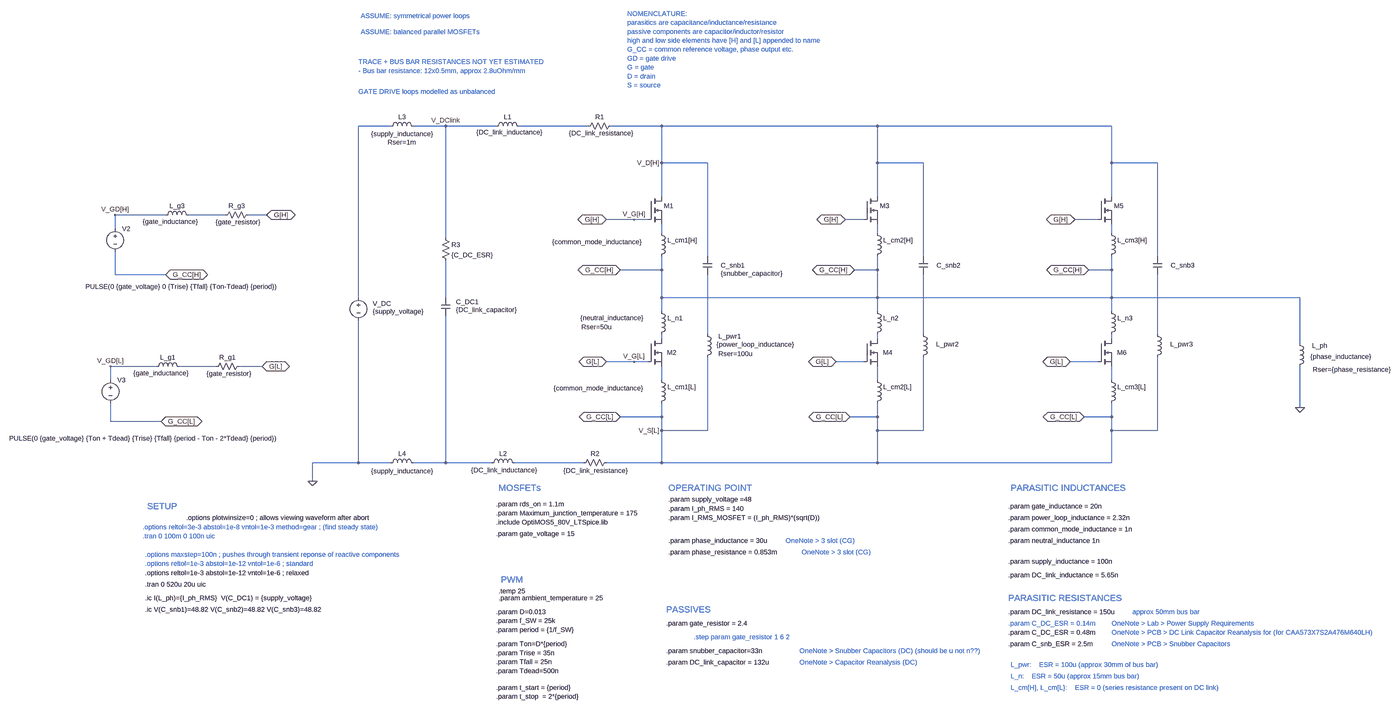
[diagram p0: schematic InverterBalanced.asc, whole sheet]
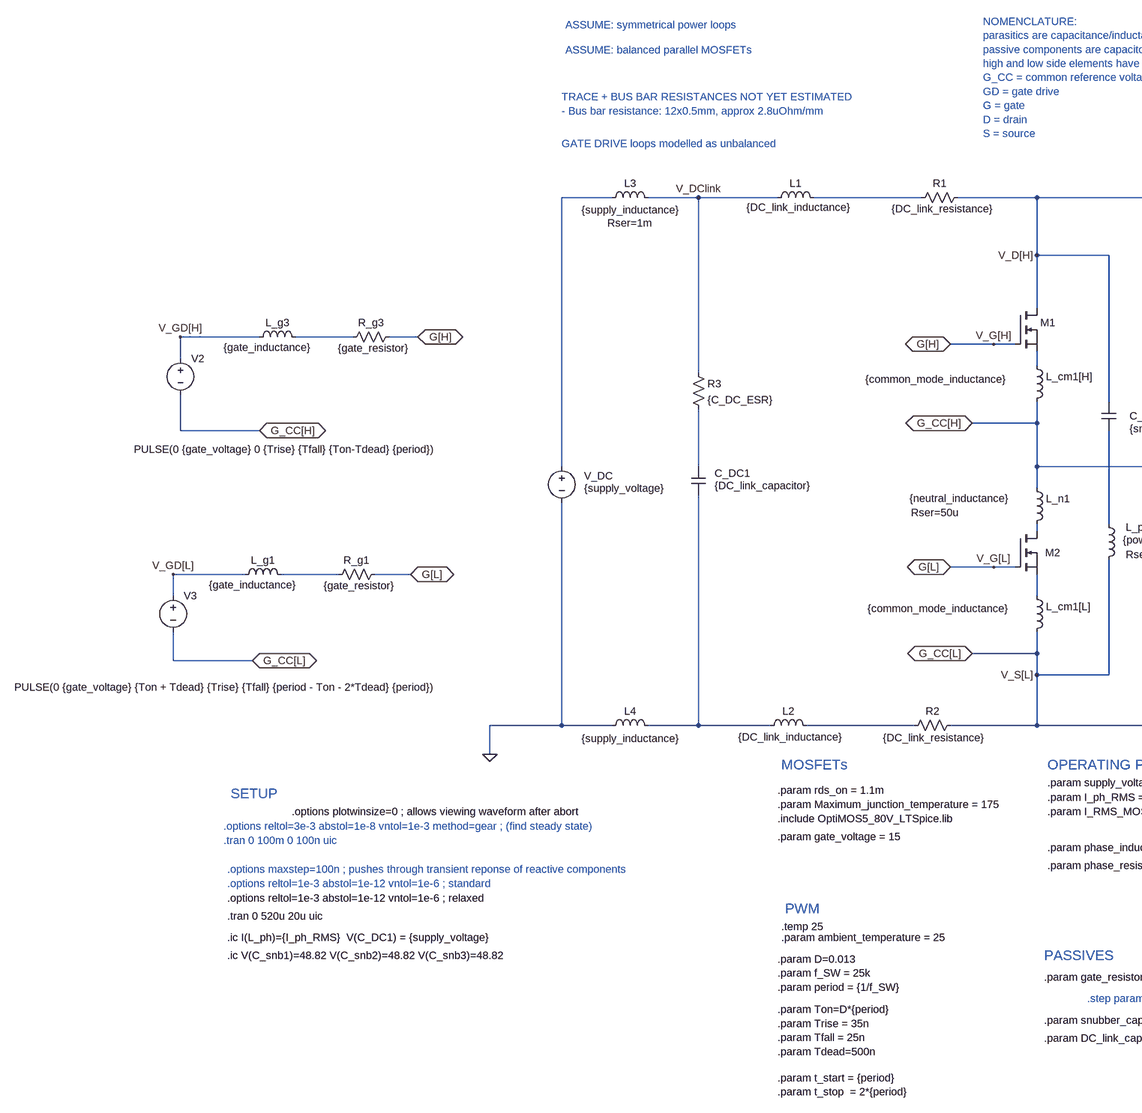
[diagram p1: schematic InverterBalanced.asc, part, row 1 of 1, column 1 of 2]
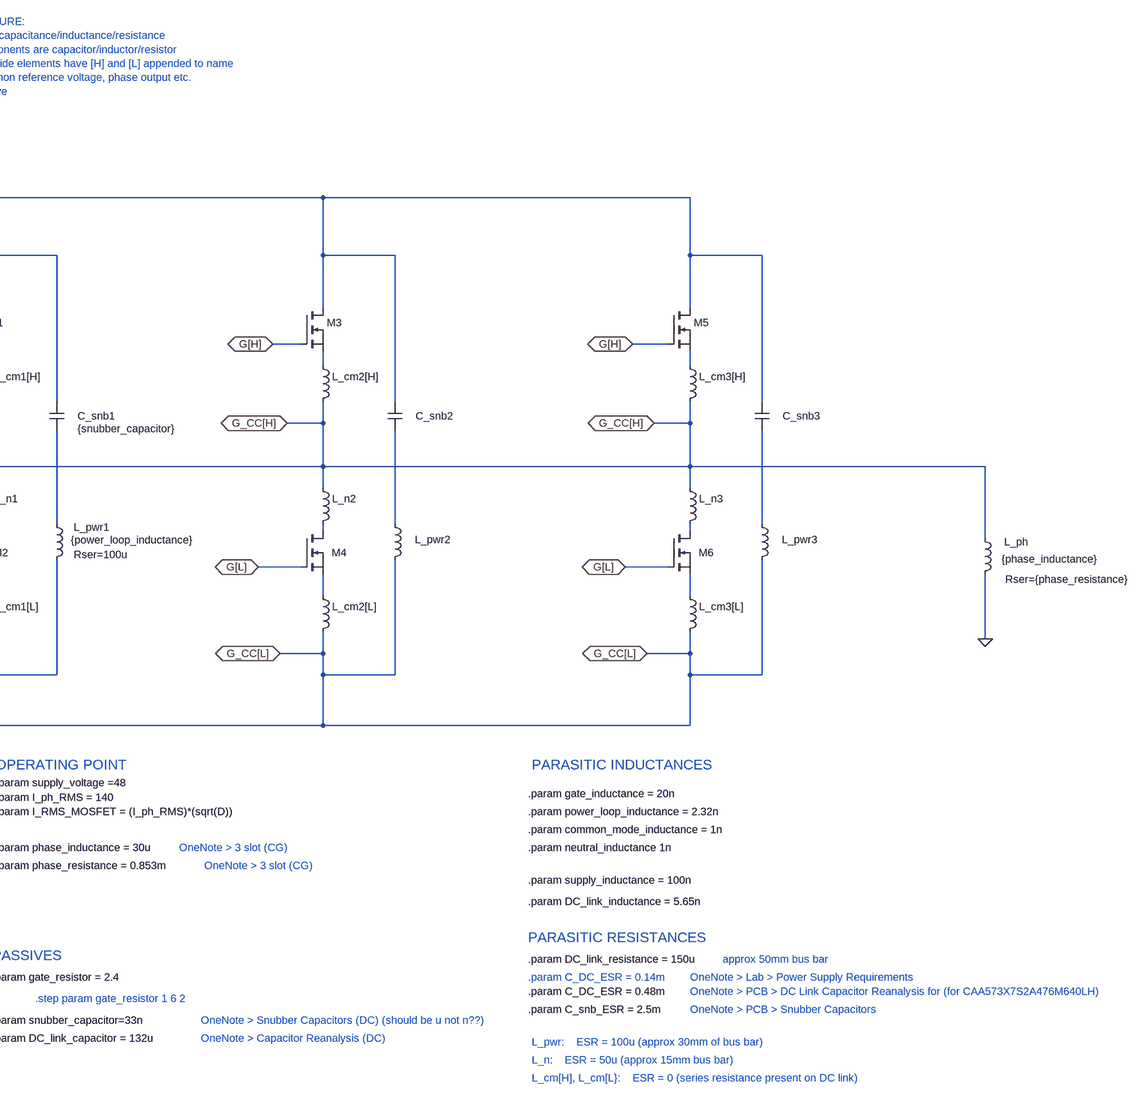
[diagram p2: schematic InverterBalanced.asc, part, row 1 of 1, column 2 of 2]
InverterBalanced.asc, the LTspice schematic file:
Version 4.1
SHEET 1 7948 3392
WIRE 1136 -928 1024 -928
WIRE 1328 -928 1216 -928
WIRE 1504 -928 1328 -928
WIRE 1824 -928 1584 -928
WIRE 2080 -928 1904 -928
WIRE 2832 -928 2080 -928
WIRE 3648 -928 2832 -928
WIRE 2080 -800 2080 -928
WIRE 2240 -800 2080 -800
WIRE 2832 -800 2832 -928
WIRE 2992 -800 2832 -800
WIRE 3648 -800 3648 -928
WIRE 3808 -800 3648 -800
WIRE 2080 -672 2080 -800
WIRE 2832 -672 2832 -800
WIRE 3648 -672 3648 -800
WIRE 352 -608 176 -608
WIRE 560 -608 432 -608
WIRE 704 -608 640 -608
WIRE 1984 -592 1888 -592
WIRE 2032 -592 1984 -592
WIRE 2080 -592 2080 -608
WIRE 2784 -592 2720 -592
WIRE 2832 -592 2832 -608
WIRE 3600 -592 3520 -592
WIRE 3648 -592 3648 -608
WIRE 176 -560 176 -608
WIRE 2080 -544 2080 -576
WIRE 2832 -544 2832 -576
WIRE 3648 -544 3648 -576
WIRE 1328 -528 1328 -928
WIRE 2240 -464 2240 -800
WIRE 2992 -464 2992 -800
WIRE 3808 -464 3808 -800
WIRE 2080 -416 2080 -464
WIRE 2080 -416 1936 -416
WIRE 2832 -416 2832 -464
WIRE 2832 -416 2752 -416
WIRE 3648 -416 3648 -464
WIRE 3648 -416 3568 -416
WIRE 176 -400 176 -480
WIRE 352 -400 176 -400
WIRE 1024 -320 1024 -928
WIRE 1328 -320 1328 -448
WIRE 2080 -320 2080 -416
WIRE 2832 -320 2832 -416
WIRE 2832 -320 2080 -320
WIRE 3648 -320 3648 -416
WIRE 3648 -320 2832 -320
WIRE 4304 -320 3648 -320
WIRE 2080 -272 2080 -320
WIRE 2832 -272 2832 -320
WIRE 3648 -272 3648 -320
WIRE 2240 -192 2240 -400
WIRE 2992 -192 2992 -400
WIRE 3808 -192 3808 -400
WIRE 2080 -176 2080 -192
WIRE 2832 -176 2832 -192
WIRE 3648 -176 3648 -192
WIRE 4304 -160 4304 -320
WIRE 1984 -96 1888 -96
WIRE 2032 -96 1984 -96
WIRE 2784 -96 2688 -96
WIRE 3600 -96 3504 -96
WIRE 320 -80 160 -80
WIRE 528 -80 400 -80
WIRE 688 -80 608 -80
WIRE 160 -32 160 -80
WIRE 2080 -32 2080 -80
WIRE 2832 -32 2832 -80
WIRE 3648 -32 3648 -80
WIRE 4304 64 4304 -80
WIRE 2080 96 2080 48
WIRE 2080 96 1936 96
WIRE 2832 96 2832 48
WIRE 2832 96 2736 96
WIRE 3648 96 3648 48
WIRE 3648 96 3552 96
WIRE 160 112 160 48
WIRE 336 112 160 112
WIRE 2080 144 2080 96
WIRE 2240 144 2240 -112
WIRE 2240 144 2080 144
WIRE 2832 144 2832 96
WIRE 2992 144 2992 -112
WIRE 2992 144 2832 144
WIRE 3648 144 3648 96
WIRE 3808 144 3808 -112
WIRE 3808 144 3648 144
WIRE 1024 256 1024 -240
WIRE 1024 256 864 256
WIRE 1136 256 1024 256
WIRE 1328 256 1328 -256
WIRE 1328 256 1216 256
WIRE 1488 256 1328 256
WIRE 1808 256 1568 256
WIRE 2080 256 2080 144
WIRE 2080 256 1888 256
WIRE 2832 256 2832 144
WIRE 2832 256 2080 256
WIRE 3648 256 3648 144
WIRE 3648 256 2832 256
WIRE 864 320 864 256
FLAG 4304 64 0
FLAG 704 -608 G[H]
IOPIN 704 -608 BiDir
FLAG 688 -80 G[L]
IOPIN 688 -80 BiDir
FLAG 1888 -592 G[H]
IOPIN 1888 -592 BiDir
FLAG 1888 -96 G[L]
IOPIN 1888 -96 BiDir
FLAG 864 320 0
FLAG 1936 -416 G_CC[H]
IOPIN 1936 -416 BiDir
FLAG 352 -400 G_CC[H]
IOPIN 352 -400 BiDir
FLAG 1984 -592 V_G[H]
FLAG 1984 -96 V_G[L]
FLAG 2080 -800 V_D[H]
FLAG 2080 144 V_S[L]
FLAG 176 -608 V_GD[H]
FLAG 160 -80 V_GD[L]
FLAG 1328 -928 V_DClink
FLAG 2720 -592 G[H]
IOPIN 2720 -592 BiDir
FLAG 1936 96 G_CC[L]
IOPIN 1936 96 BiDir
FLAG 336 112 G_CC[L]
IOPIN 336 112 BiDir
FLAG 2688 -96 G[L]
IOPIN 2688 -96 BiDir
FLAG 3504 -96 G[L]
IOPIN 3504 -96 BiDir
FLAG 3520 -592 G[H]
IOPIN 3520 -592 BiDir
FLAG 2752 -416 G_CC[H]
IOPIN 2752 -416 BiDir
FLAG 3568 -416 G_CC[H]
IOPIN 3568 -416 BiDir
FLAG 2736 96 G_CC[L]
IOPIN 2736 96 BiDir
FLAG 3552 96 G_CC[L]
IOPIN 3552 96 BiDir
SYMBOL voltage 1024 -336 R0
WINDOW 3 50 65 Left 2
WINDOW 0 50 37 Left 2
WINDOW 123 0 0 Left 0
SYMATTR Value {supply_voltage}
SYMATTR InstName V_DC
SYMATTR SpiceLine Rser=0
SYMBOL cap 1312 -320 R0
WINDOW 0 52 15 Left 2
WINDOW 3 52 43 Left 2
SYMATTR InstName C_DC1
SYMATTR Value {DC_link_capacitor}
SYMATTR SpiceLine Rser=0
SYMBOL voltage 176 -576 R0
WINDOW 123 0 0 Left 0
WINDOW 39 0 0 Left 0
WINDOW 3 -103 218 Left 2
SYMATTR Value PULSE(0 {gate_voltage} 0 {Trise} {Tfall} {Ton-Tdead} {period})
SYMATTR InstName V2
SYMBOL voltage 160 -48 R0
WINDOW 123 0 0 Left 0
WINDOW 39 0 0 Left 0
WINDOW 3 -353 219 Left 2
SYMATTR Value PULSE(0 {gate_voltage} {Ton + Tdead} {Trise} {Tfall} {period - Ton - 2*Tdead} {period})
SYMATTR InstName V3
SYMBOL cap 2224 -464 R0
WINDOW 0 62 32 Left 2
WINDOW 3 62 60 Left 2
SYMATTR InstName C_snb1
SYMATTR Value {snubber_capacitor}
SYMATTR SpiceLine Rser=0
SYMBOL ind 4288 -176 R0
WINDOW 0 58 24 Left 2
WINDOW 3 52 62 Left 2
WINDOW 39 61 107 Left 2
SYMATTR InstName L_ph
SYMATTR Value {phase_inductance}
SYMATTR SpiceLine Rser={phase_resistance}
SYMBOL nmos 2032 -672 R0
WINDOW 3 56 72 Invisible 2
SYMATTR Value IPTG011N08NM5_L0
SYMATTR InstName M1
SYMATTR Prefix X
SYMBOL nmos 2032 -176 R0
WINDOW 0 67 48 Left 2
WINDOW 3 56 72 Invisible 2
SYMATTR InstName M2
SYMATTR Value IPTG011N08NM5_L0
SYMATTR Prefix X
SYMBOL ind 2064 -560 R0
WINDOW 3 -365 46 Left 2
SYMATTR Value {common_mode_inductance}
SYMATTR InstName L_cm1[H]
SYMATTR SpiceLine Rser=0
SYMBOL ind 2064 -48 R0
WINDOW 3 -360 44 Left 2
SYMATTR Value {common_mode_inductance}
SYMATTR InstName L_cm1[L]
SYMATTR SpiceLine Rser=0
SYMBOL ind 2224 -208 R0
WINDOW 0 54 23 Left 2
WINDOW 3 47 52 Left 2
WINDOW 39 54 84 Left 2
SYMATTR InstName L_pwr1
SYMATTR Value {power_loop_inductance}
SYMATTR SpiceLine Rser=100u
SYMBOL cap 2976 -464 R0
WINDOW 0 62 32 Left 2
WINDOW 3 24 56 Invisible 2
SYMATTR InstName C_snb2
SYMATTR Value {snubber_capacitor}
SYMBOL nmos 2784 -672 R0
WINDOW 3 56 72 Invisible 2
SYMATTR Value IPTG011N08NM5_L0
SYMATTR InstName M3
SYMATTR Prefix X
SYMBOL nmos 2784 -176 R0
WINDOW 0 67 48 Left 2
WINDOW 3 56 72 Invisible 2
SYMATTR InstName M4
SYMATTR Value IPTG011N08NM5_L0
SYMATTR Prefix X
SYMBOL ind 2816 -560 R0
WINDOW 3 36 80 Invisible 2
SYMATTR Value {common_mode_inductance}
SYMATTR InstName L_cm2[H]
SYMATTR SpiceLine Rser=0
SYMBOL ind 2816 -48 R0
WINDOW 3 36 80 Invisible 2
SYMATTR Value {common_mode_inductance}
SYMATTR InstName L_cm2[L]
SYMATTR SpiceLine Rser=0
SYMBOL ind 2976 -208 R0
WINDOW 0 60 51 Left 2
WINDOW 3 36 80 Invisible 2
SYMATTR InstName L_pwr2
SYMATTR Value {power_loop_inductance}
SYMATTR SpiceLine Rser=100u
SYMBOL cap 3792 -464 R0
WINDOW 0 62 32 Left 2
WINDOW 3 24 56 Invisible 2
SYMATTR InstName C_snb3
SYMATTR Value {snubber_capacitor}
SYMBOL nmos 3600 -672 R0
WINDOW 3 56 72 Invisible 2
SYMATTR Value IPTG011N08NM5_L0
SYMATTR InstName M5
SYMATTR Prefix X
SYMBOL nmos 3600 -176 R0
WINDOW 0 67 48 Left 2
WINDOW 3 56 72 Invisible 2
SYMATTR InstName M6
SYMATTR Value IPTG011N08NM5_L0
SYMATTR Prefix X
SYMBOL ind 3632 -560 R0
WINDOW 3 36 80 Invisible 2
SYMATTR Value {common_mode_inductance}
SYMATTR InstName L_cm3[H]
SYMATTR SpiceLine Rser=0
SYMBOL ind 3632 -48 R0
WINDOW 3 36 80 Invisible 2
SYMATTR Value {common_mode_inductance}
SYMATTR InstName L_cm3[L]
SYMATTR SpiceLine Rser=0
SYMBOL ind 3792 -208 R0
WINDOW 0 60 51 Left 2
WINDOW 3 36 80 Invisible 2
SYMATTR InstName L_pwr3
SYMATTR Value {power_loop_inductance}
SYMATTR SpiceLine Rser=100u
SYMBOL ind 1488 -912 R270
WINDOW 0 32 56 VTop 2
WINDOW 3 -21 62 VTop 2
SYMATTR InstName L1
SYMATTR Value {DC_link_inductance}
SYMATTR SpiceLine Rser=0
SYMBOL ind 1472 272 R270
WINDOW 0 32 56 VTop 2
WINDOW 3 -26 60 VTop 2
SYMATTR InstName L2
SYMATTR Value {DC_link_inductance}
SYMATTR SpiceLine Rser=0
SYMBOL ind 336 -592 R270
WINDOW 0 32 56 VTop 2
WINDOW 3 -23 33 VTop 2
SYMATTR InstName L_g3
SYMATTR Value {gate_inductance}
SYMATTR SpiceLine Rser=0
SYMBOL res 544 -592 R270
WINDOW 0 32 56 VTop 2
WINDOW 3 -25 61 VTop 2
SYMATTR InstName R_g3
SYMATTR Value {gate_resistor}
SYMBOL res 1920 -944 R90
WINDOW 0 0 56 VBottom 2
WINDOW 3 57 51 VBottom 2
SYMATTR InstName R1
SYMATTR Value {DC_link_resistance}
SYMBOL res 1904 240 R90
WINDOW 0 0 56 VBottom 2
WINDOW 3 59 54 VBottom 2
SYMATTR InstName R2
SYMATTR Value {DC_link_resistance}
SYMBOL ind 1120 -912 R270
WINDOW 0 32 56 VTop 2
WINDOW 3 -27 56 VTop 2
WINDOW 39 -56 55 VTop 2
SYMATTR InstName L3
SYMATTR Value {supply_inductance}
SYMATTR SpiceLine Rser=1m
SYMBOL ind 1120 272 R270
WINDOW 0 32 56 VTop 2
WINDOW 3 -29 56 VTop 2
SYMATTR InstName L4
SYMATTR Value {supply_inductance}
SYMATTR SpiceLine Rser=1m
SYMBOL res 1312 -544 R0
SYMATTR InstName R3
SYMATTR Value {C_DC_ESR}
SYMBOL ind 304 -64 R270
WINDOW 0 32 56 VTop 2
WINDOW 3 -23 33 VTop 2
SYMATTR InstName L_g1
SYMATTR Value {gate_inductance}
SYMATTR SpiceLine Rser=0
SYMBOL res 512 -64 R270
WINDOW 0 32 56 VTop 2
WINDOW 3 -25 61 VTop 2
SYMATTR InstName R_g1
SYMATTR Value {gate_resistor}
SYMBOL ind 2064 -288 R0
WINDOW 3 -267 39 Left 2
WINDOW 39 -264 71 Left 2
SYMATTR Value {neutral_inductance}
SYMATTR SpiceLine Rser=50u
SYMATTR InstName L_n1
SYMBOL ind 2816 -288 R0
WINDOW 3 -263 42 Invisible 2
SYMATTR Value {neutral_inductance}
SYMATTR InstName L_n2
SYMATTR SpiceLine Rser=50u
SYMBOL ind 3632 -288 R0
WINDOW 3 -265 41 Invisible 2
SYMATTR Value {neutral_inductance}
SYMATTR InstName L_n3
SYMATTR SpiceLine Rser=50u
TEXT 1504 776 Left 2 !.param D=0.013\n.param f_SW = 25k\n.param period = {1/f_SW}
TEXT 280 608 Left 2 ;.options reltol=1e-3 abstol=1e-12 vntol=1e-6 ; standard
TEXT 1504 464 Left 2 !.include OptiMOS5_80V_LTSpice.lib
TEXT 1512 704 Left 2 !.temp 25
TEXT 2096 912 Left 2 !.param snubber_capacitor=33n
TEXT 2096 952 Left 2 !.param DC_link_capacitor = 132u
TEXT 2104 384 Left 2 !.param supply_voltage =48
TEXT 2104 568 Left 2 !.param phase_resistance = 0.853m
TEXT 2104 528 Left 2 !.param phase_inductance = 30u
TEXT 1504 1040 Left 2 !.param t_start = {period}\n.param t_stop  = 2*{period}
TEXT 2104 416 Left 2 !.param I_ph_RMS = 140
TEXT 2104 448 Left 2 !.param I_RMS_MOSFET = (I_ph_RMS)*(sqrt(D))
TEXT 1512 728 Left 2 !.param ambient_temperature = 25
TEXT 1504 432 Left 2 !.param Maximum_junction_temperature = 175
TEXT 1504 400 Left 2 !.param rds_on = 1.1m
TEXT 280 728 Left 2 !.ic I(L_ph)={I_ph_RMS}  V(C_DC1) = {supply_voltage}
TEXT 3288 488 Left 2 !.param common_mode_inductance = 1n
TEXT 3288 448 Left 2 !.param power_loop_inductance = 2.32n
TEXT 2096 816 Left 2 !.param gate_resistor = 2.4
TEXT 3288 408 Left 2 !.param gate_inductance = 20n
TEXT 288 408 Left 3 ;SETUP
TEXT 1512 344 Left 3 ;MOSFETs
TEXT 2104 344 Left 3 ;OPERATING POINT
TEXT 3296 344 Left 3 ;PARASITIC INDUCTANCES
TEXT 2096 768 Left 3 ;PASSIVES
TEXT 1504 504 Left 2 !.param gate_voltage = 15
TEXT 2192 864 Left 2 ;.step param gate_resistor 1 6 2
TEXT 3288 648 Left 2 !.param DC_link_inductance = 5.65n
TEXT 1032 -1312 Left 2 ;ASSUME: symmetrical power loops
TEXT 1024 -1152 Left 2 ;TRACE + BUS BAR RESISTANCES NOT YET ESTIMATED\n- Bus bar resistance: 12x0.5mm, approx 2.8uOhm/mm
TEXT 1032 -1256 Left 2 ;ASSUME: balanced parallel MOSFETs
TEXT 1504 888 Left 2 !.param Ton=D*{period}\n.param Trise = 35n\n.param Tfall = 25n\n.param Tdead=500n
TEXT 272 512 Left 2 ;.tran 0 100m 0 100n uic
TEXT 280 768 Left 2 !.ic V(C_snb1)=48.82 V(C_snb2)=48.82 V(C_snb3)=48.82
TEXT 1024 -1048 Left 2 ;GATE DRIVE loops modelled as unbalanced
TEXT 3288 600 Left 2 !.param supply_inductance = 100n
TEXT 3288 728 Left 3 ;PARASITIC RESISTANCES
TEXT 3288 776 Left 2 !.param DC_link_resistance = 150u
TEXT 3288 816 Left 2 ;.param C_DC_ESR = 0.14m
TEXT 2560 952 Left 2 ;OneNote > Capacitor Reanalysis (DC)
TEXT 2560 912 Left 2 ;OneNote > Snubber Capacitors (DC) (should be u not n??)
TEXT 2512 528 Left 2 ;OneNote > 3 slot (CG)
TEXT 2568 568 Left 2 ;OneNote > 3 slot (CG)
TEXT 424 448 Left 2 !.options plotwinsize=0 ; allows viewing waveform after abort
TEXT 1960 -1320 Left 2 ;NOMENCLATURE: \nparasitics are capacitance/inductance/resistance\npassive components are capacitor/inductor/resistor\nhigh and low side elements have [H] and [L] appended to name\nG_CC = common reference voltage, phase output etc.\nGD = gate drive\nG = gate\nD = drain\nS = source
TEXT 280 576 Left 2 ;.options maxstep=100n ; pushes through transient reponse of reactive components
TEXT 280 640 Left 2 !.options reltol=1e-3 abstol=1e-12 vntol=1e-6 ; relaxed
TEXT 272 480 Left 2 ;.options reltol=3e-3 abstol=1e-8 vntol=1e-3 method=gear ; (find steady state)
TEXT 280 680 Left 2 !.tran 0 520u 20u uic
TEXT 1520 664 Left 3 ;PWM
TEXT 3288 528 Left 2 !.param neutral_inductance 1n
TEXT 3296 960 Left 2 ;L_pwr:    ESR = 100u (approx 30mm of bus bar)
TEXT 3296 1040 Left 2 ;L_cm[H], L_cm[L}:    ESR = 0 (series resistance present on DC link)
TEXT 3296 1000 Left 2 ;L_n:    ESR = 50u (approx 15mm bus bar)
TEXT 3648 816 Left 2 ;OneNote > Lab > Power Supply Requirements
TEXT 3288 888 Left 2 !.param C_snb_ESR = 2.5m
TEXT 3288 848 Left 2 !.param C_DC_ESR = 0.48m
TEXT 3648 848 Left 2 ;OneNote > PCB > DC Link Capacitor Reanalysis for (for CAA573X7S2A476M640LH)
TEXT 3720 776 Left 2 ;approx 50mm bus bar
TEXT 3648 888 Left 2 ;OneNote > PCB > Snubber Capacitors

The netlist it stands for:
* InverterBalanced.asc
V_DC N001 0 {supply_voltage} Rser=0
C_DC1 N010 N021 {DC_link_capacitor} Rser=0
V2 V_GD[H] G_CC[H] PULSE(0 {gate_voltage} 0 {Trise} {Tfall} {Ton-Tdead} {period})
V3 V_GD[L] G_CC[L] PULSE(0 {gate_voltage} {Ton + Tdead} {Trise} {Tfall} {period - Ton - 2*Tdead} {period})
C_snb1 V_D[H] N011 {snubber_capacitor} Rser=0
L_ph G_CC[H] 0 {phase_inductance} Rser={phase_resistance}
X§M1 V_D[H] V_G[H] N007 IPTG011N08NM5_L0  ; pins D G S
X§M2 N014 V_G[L] N018 IPTG011N08NM5_L0  ; pins D G S
L_cm1[H] N007 G_CC[H] {common_mode_inductance} Rser=0
L_cm1[L] N018 G_CC[L] {common_mode_inductance} Rser=0
L_pwr1 N011 G_CC[L] {power_loop_inductance} Rser=100u
C_snb2 V_D[H] N012 {snubber_capacitor}
X§M3 V_D[H] V_G[H] N008 IPTG011N08NM5_L0  ; pins D G S
X§M4 N015 V_G[L] N019 IPTG011N08NM5_L0  ; pins D G S
L_cm2[H] N008 G_CC[H] {common_mode_inductance} Rser=0
L_cm2[L] N019 G_CC[L] {common_mode_inductance} Rser=0
L_pwr2 N012 G_CC[L] {power_loop_inductance} Rser=100u
C_snb3 V_D[H] N013 {snubber_capacitor}
X§M5 V_D[H] V_G[H] N009 IPTG011N08NM5_L0  ; pins D G S
X§M6 N016 V_G[L] N020 IPTG011N08NM5_L0  ; pins D G S
L_cm3[H] N009 G_CC[H] {common_mode_inductance} Rser=0
L_cm3[L] N020 G_CC[L] {common_mode_inductance} Rser=0
L_pwr3 N013 G_CC[L] {power_loop_inductance} Rser=100u
L1 V_DClink N002 {DC_link_inductance} Rser=0
L2 N021 N022 {DC_link_inductance} Rser=0
L_g3 V_GD[H] N003 {gate_inductance} Rser=0
R_g3 N003 V_G[H] {gate_resistor}
R1 V_D[H] N002 {DC_link_resistance}
R2 G_CC[L] N022 {DC_link_resistance}
L3 N001 V_DClink {supply_inductance} Rser=1m
L4 0 N021 {supply_inductance} Rser=1m
R3 V_DClink N010 {C_DC_ESR}
L_g1 V_GD[L] N017 {gate_inductance} Rser=0
R_g1 N017 V_G[L] {gate_resistor}
L_n1 G_CC[H] N014 {neutral_inductance} Rser=50u
L_n2 G_CC[H] N015 {neutral_inductance} Rser=50u
L_n3 G_CC[H] N016 {neutral_inductance} Rser=50u
.param D=0.013
.param f_SW = 25k
.param period = {1/f_SW}
* .options reltol=1e-3 abstol=1e-12 vntol=1e-6 ; standard
.include OptiMOS5_80V_LTSpice.lib
.temp 25
.param snubber_capacitor=33n
.param DC_link_capacitor = 132u
.param supply_voltage =48
.param phase_resistance = 0.853m
.param phase_inductance = 30u
.param t_start = {period}
.param t_stop  = 2*{period}
.param I_ph_RMS = 140
.param I_RMS_MOSFET = (I_ph_RMS)*(sqrt(D))
.param ambient_temperature = 25
.param Maximum_junction_temperature = 175
.param rds_on = 1.1m
.ic I(L_ph)={I_ph_RMS}  V(C_DC1) = {supply_voltage}
.param common_mode_inductance = 1n
.param power_loop_inductance = 2.32n
.param gate_resistor = 2.4
.param gate_inductance = 20n
* SETUP
* MOSFETs
* OPERATING POINT
* PARASITIC INDUCTANCES
* PASSIVES
.param gate_voltage = 15
* .step param gate_resistor 1 6 2
.param DC_link_inductance = 5.65n
* ASSUME: symmetrical power loops
* TRACE + BUS BAR RESISTANCES NOT YET ESTIMATED
* - Bus bar resistance: 12x0.5mm, approx 2.8uOhm/mm
* ASSUME: balanced parallel MOSFETs
.param Ton=D*{period}
.param Trise = 35n
.param Tfall = 25n
.param Tdead=500n
* .tran 0 100m 0 100n uic
.ic V(C_snb1)=48.82 V(C_snb2)=48.82 V(C_snb3)=48.82
* GATE DRIVE loops modelled as unbalanced
.param supply_inductance = 100n
* PARASITIC RESISTANCES
.param DC_link_resistance = 150u
* .param C_DC_ESR = 0.14m
* OneNote > Capacitor Reanalysis (DC)
* OneNote > Snubber Capacitors (DC) (should be u not n??)
* OneNote > 3 slot (CG)
* OneNote > 3 slot (CG)
.options plotwinsize=0 ; allows viewing waveform after abort
* NOMENCLATURE:
* parasitics are capacitance/inductance/resistance
* passive components are capacitor/inductor/resistor
* high and low side elements have [H] and [L] appended to name
* G_CC = common reference voltage, phase output etc.
* GD = gate drive
* G = gate
* D = drain
* S = source
* .options maxstep=100n ; pushes through transient reponse of reactive components
.options reltol=1e-3 abstol=1e-12 vntol=1e-6 ; relaxed
* .options reltol=3e-3 abstol=1e-8 vntol=1e-3 method=gear ; (find steady state)
.tran 0 520u 20u uic
* PWM
.param neutral_inductance 1n
* L_pwr:    ESR = 100u (approx 30mm of bus bar)
* L_cm[H], L_cm[L}:    ESR = 0 (series resistance present on DC link)
* L_n:    ESR = 50u (approx 15mm bus bar)
* OneNote > Lab > Power Supply Requirements
.param C_snb_ESR = 2.5m
.param C_DC_ESR = 0.48m
* OneNote > PCB > DC Link Capacitor Reanalysis for (for CAA573X7S2A476M640LH)
* approx 50mm bus bar
* OneNote > PCB > Snubber Capacitors
.backanno
.end